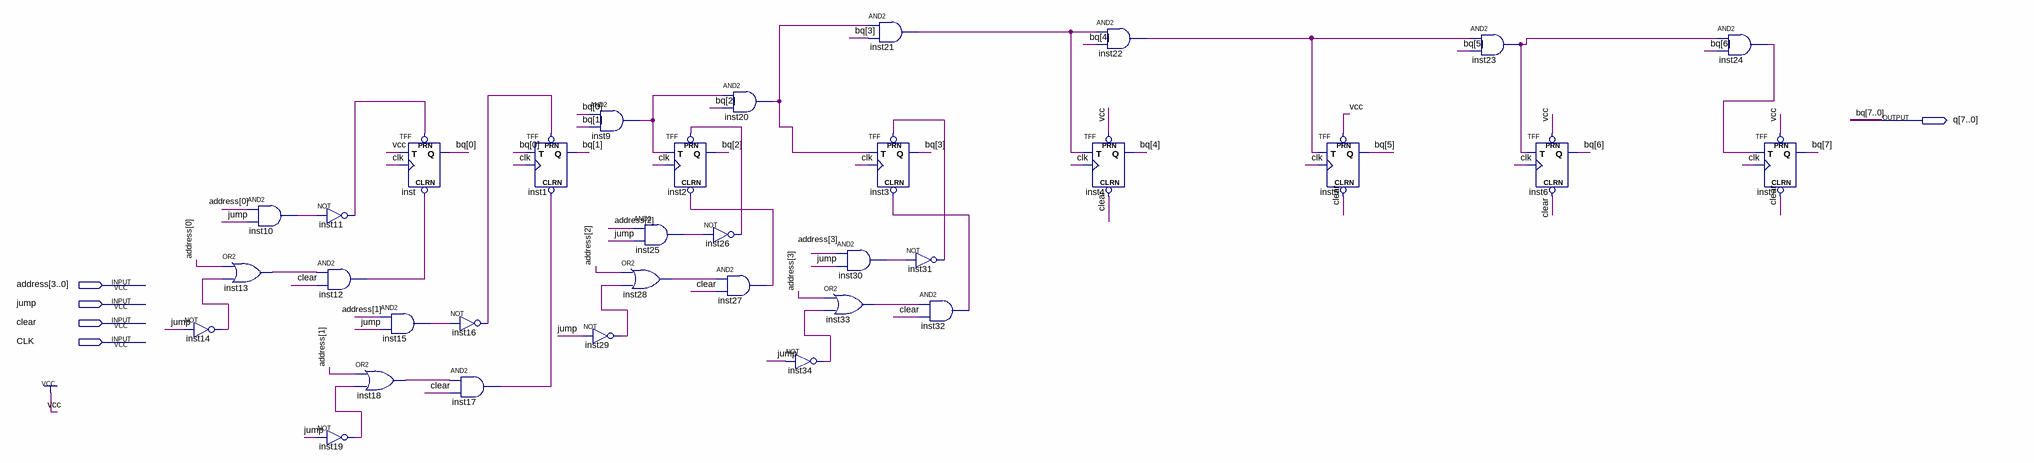
[diagram p0: schematic sheet]
// Quartus schematic Count8.bdf as structural Verilog: 34 symbols, 5 pins
module Count8 (
  input  [3:0] address,
  input  jump,
  input  clear,
  input  CLK,
  output [7:0] q
);

  wire inst9_out, inst10_out, inst11_out, inst12_out, inst13_out, inst14_out, inst15_out, inst16_out,
       inst17_out, inst18_out, inst19_out, inst20_out, inst21_out, inst22_out, inst23_out, inst24_out,
       inst25_out, inst26_out, inst27_out, inst28_out, inst29_out, inst30_out, inst31_out, inst32_out,
       inst33_out, inst34_out;

  not inst14 (inst14_out, jump);
  and inst10 (inst10_out, address[0], jump);
  or inst13 (inst13_out, address[0], inst14_out);
  not inst11 (inst11_out, inst10_out);
  and inst12 (inst12_out, inst13_out, clear);
  not inst19 (inst19_out, jump);
  TFF inst (.PRN(inst11_out), .CLRN(inst12_out), .T(1'b1), .CLK(CLK), .Q(q[0]));
  and inst15 (inst15_out, address[1], jump);
  or inst18 (inst18_out, address[1], inst19_out);
  not inst16 (inst16_out, inst15_out);
  and inst17 (inst17_out, inst18_out, clear);
  TFF inst1 (.PRN(inst16_out), .CLRN(inst17_out), .T(q[0]), .CLK(CLK), .Q(q[1]));
  and inst9 (inst9_out, q[0], q[1]);
  not inst29 (inst29_out, jump);
  and inst25 (inst25_out, address[2], jump);
  or inst28 (inst28_out, address[2], inst29_out);
  TFF inst2 (.PRN(inst26_out), .CLRN(inst27_out), .T(inst9_out), .CLK(CLK), .Q(q[2]));
  not inst26 (inst26_out, inst25_out);
  and inst20 (inst20_out, inst9_out, q[2]);
  and inst27 (inst27_out, inst28_out, clear);
  not inst34 (inst34_out, jump);
  and inst30 (inst30_out, address[3], jump);
  or inst33 (inst33_out, address[3], inst34_out);
  and inst21 (inst21_out, inst20_out, q[3]);
  TFF inst3 (.PRN(inst31_out), .CLRN(inst32_out), .T(inst20_out), .CLK(CLK), .Q(q[3]));
  not inst31 (inst31_out, inst30_out);
  and inst32 (inst32_out, inst33_out, clear);
  and inst22 (inst22_out, inst21_out, q[4]);
  TFF inst4 (.PRN(1'b1), .CLRN(clear), .T(inst21_out), .CLK(CLK), .Q(q[4]));
  TFF inst5 (.PRN(1'b1), .CLRN(clear), .T(inst22_out), .CLK(CLK), .Q(q[5]));
  and inst23 (inst23_out, inst22_out, q[5]);
  TFF inst6 (.PRN(1'b1), .CLRN(clear), .T(inst23_out), .CLK(CLK), .Q(q[6]));
  and inst24 (inst24_out, inst23_out, q[6]);
  TFF inst7 (.PRN(1'b1), .CLRN(clear), .T(inst24_out), .CLK(CLK), .Q(q[7]));

  // Other names for the same wires on the sheet: bq[7:0] = q
endmodule
